# EasyEDA Pro project ProPrj_小中心板_2025-08-09.epro, board PCB1_1
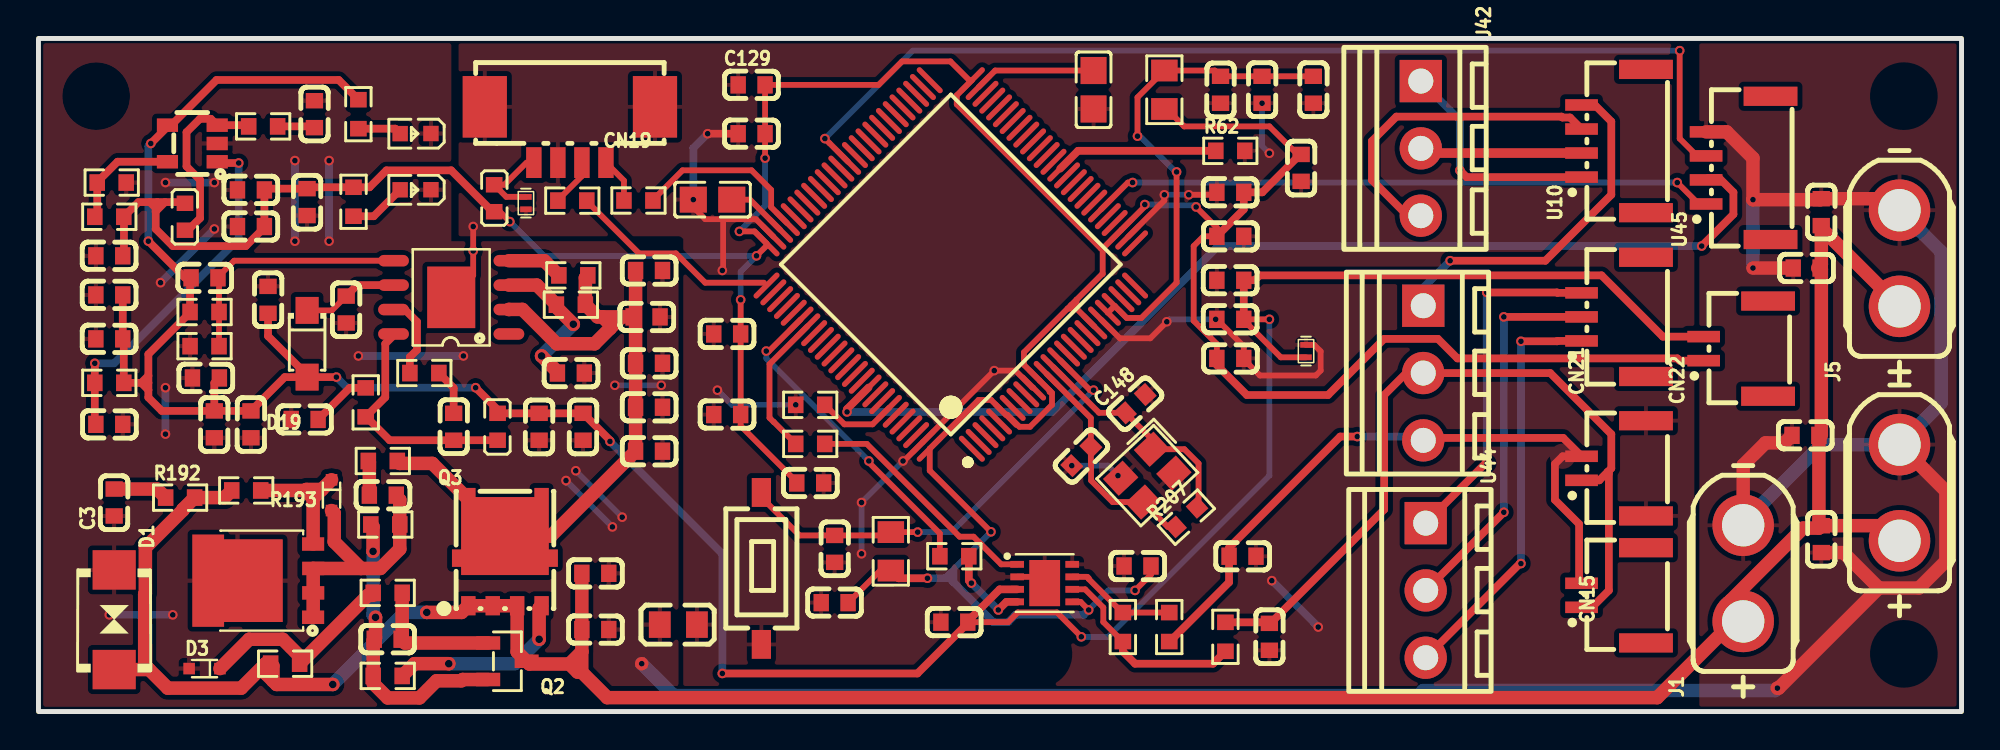
[diagram p8: board, top side]
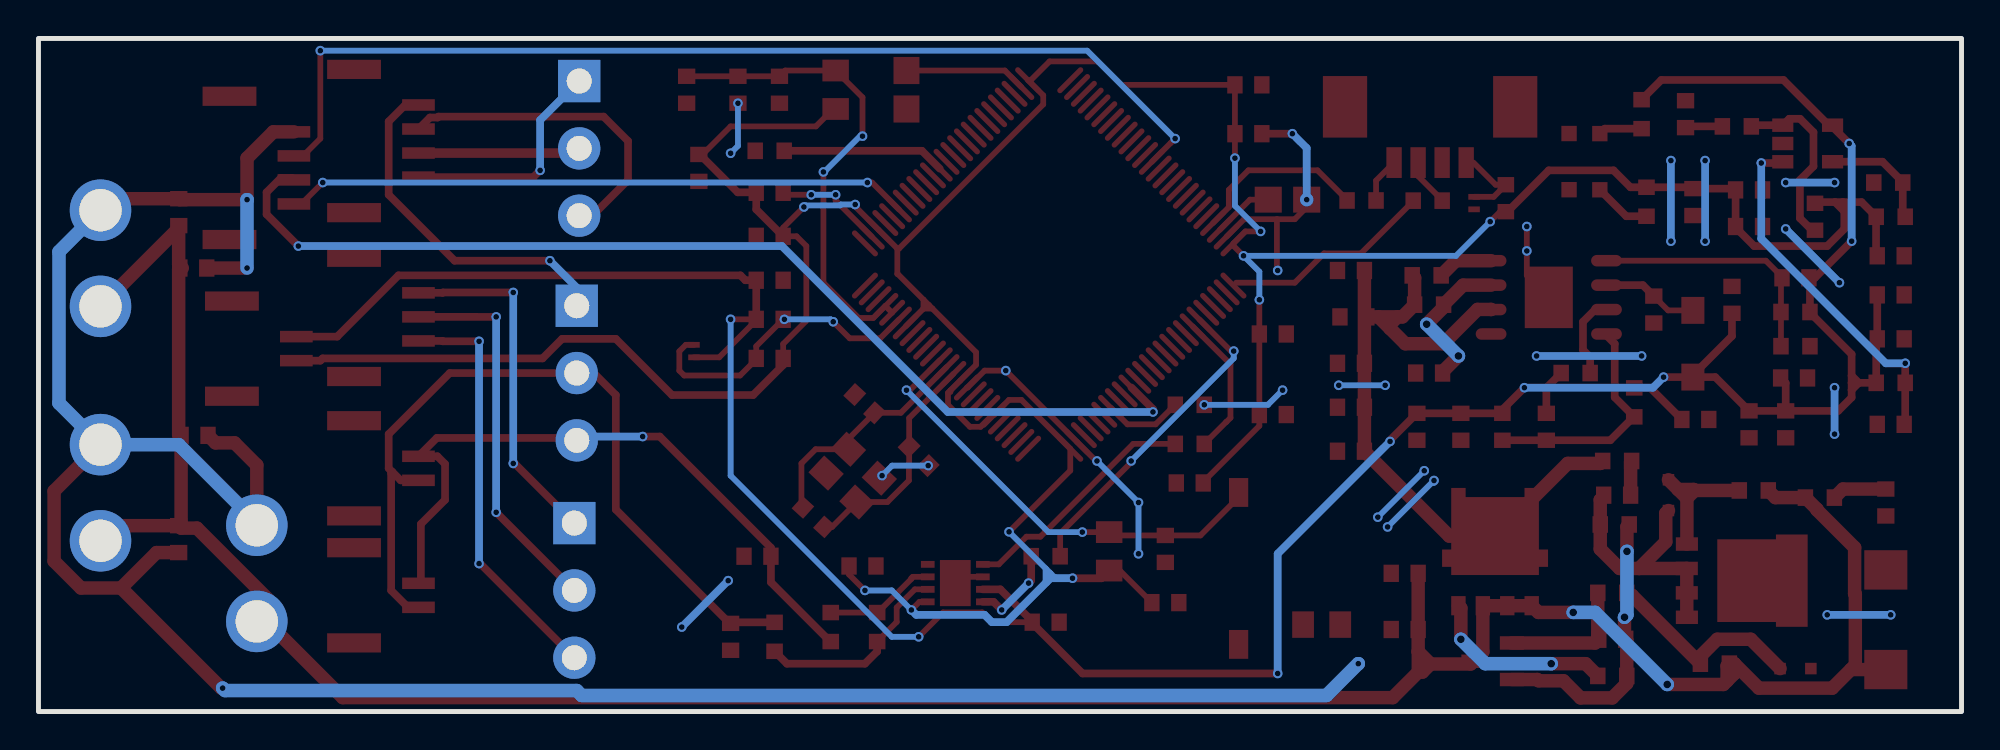
[diagram p9: board, bottom side, seen from below]

Outline 100 x 35 mm; copper layers: Top Layer, Bottom Layer. Coordinates in mm from the lower left corner of the outline.
Outline path: rectangle 0,35 100,0
Stack: Top Layer 0.035mm / Dielectric1 1.51mm FR4 er 4.5 / Bottom Layer 0.035mm

## Design rules (mm)
net VCC_5V: DP1
net SWCLK: DP1
template: JLCPCB Capability(Two Layers Board)
spacing copperThickness1oz (default): track to track 0.102, other pairs 0.152 to 0.3
spacing copperThickness2oz: track to track 0.203, other pairs 0.152 to 0.3
track width copperThickness1oz (default): min 0.127, default 0.254, max 2.54
track width copperThickness2oz: min 0.203, default 0.254, max 2.54
differential pair differentialPair (default): width min 0.127, default 0.254, max 2.54; gap min 0.152, default 0.152
via viaSize (default): diameter min 0.5, default 0.61, max 10; hole min 0.3, default 0.305, max 6.3

## Placement (name value [footprint] x y rotation side)
2.2uf  100nF  [C0603]  61.47 32.33 90 top
C1  22uf  [C0603]  28.96 4.27 180 top
C2  100nF  [C0603]  18.16 3.76 0 top
C3  10nf  [C0603]  3.94 10.87 90 top
C4  22uF  [C0603]  28.96 7.19 180 top
C29  330pF  [C0603]  13.84 15.19 0 top
C31  22uF  [C0603]  11.94 21.41 270 top
C32  22uF  [C0603]  8.71 17.35 0 top
C34_107  106  [C0603]  66.29 32.33 270 top
C35_105  104  [C0603]  63.63 32.33 270 top
C39  10uF  [C0603]  3.68 21.67 0 top
C40  1uF  [C0603]  3.68 14.93 180 top
C41  100pF  [C0603]  14.35 31.06 270 top
C43  1nF  [C0603]  11.05 25.22 0 top
C44  22uF  [C0603]  13.97 26.49 90 top
C93  1uF  [C0603]  27.69 17.6 180 top
C98  2.2uf  [C0805]  54.86 32.33 270 top
C99  2.2uf  [C0805]  35.05 26.62 180 top
C102  104  [c0603]  41.4 8.46 270 top
C104  10uF  [C0603]  31.75 13.54 180 top
C105  4.7uf  [C0603]  31.75 22.94 180 top
C106  4.7uf  [C0603]  31.62 20.52 180 top
C107  4.7uf  [C0603]  31.75 18.11 180 top
C108  100nf  [C0603]  31.75 15.82 180 top
C109  100nf  [C0603]  21.59 14.81 270 top
C110  1uF  [C0603]  11.05 14.93 90 top
C111  47pF  [C0603]  8.64 22.55 180 top
C112  1uF  [C0603]  28.32 14.81 90 top
C113  100nF  [C0603]  26.03 14.81 90 top
C114  1nF  [C0603]  9.14 14.93 90 top
C118  10nf  [C0603]  17.91 11.25 180 top
C124  100nf  [C0603]  16 20.9 90 top
C125  4.7uF  [C0603]  61.98 24.71 180 top
C126  4.7uF  [C0603]  41.4 5.66 0 top
C127  100nF  [C0603]  35.81 15.44 0 top
C128  100nf  [C0603]  35.81 19.63 0 top
C129  100nf  [C0603]  37.08 32.59 0 top
C130  100nf  [C0603]  61.98 18.36 180 top
C131  100nf  [C0603]  65.66 28.27 90 top
C132  100nf  [C0603]  61.98 27 0 top
C133  100nf  [C0603]  37.08 30.05 0 top
C134  100nf  [C0603]  40.13 11.89 180 top
C144  100nf  [C0603]  3.68 19.38 0 top
C145  1uF  [C0603]  11.05 27.13 0 top
C146  100nF  [C0603]  3.68 23.7 0 top
C147  12.0pF  [C0603]  54.23 13.28 225 top
C148  12.0pF  [C0603]  57.04 16.01 42.6 top
C157  1uF  [C0603]  61.98 20.39 0 top
C158  100nF  [C0603]  61.98 22.43 0 top
C165  330pF  [C0603]  62.61 8.08 180 top
C166  330pF  [C0603]  64.01 3.89 270 top
C167  100nF  [C0603]  57.15 7.57 180 top
C168  100nF  [C0603]  47.62 4.65 0 top
C169  22uf  [C0603]  91.95 23.06 0 top
C170  22uF  [C0603]  92.7 25.97 270 top
C175  22uf  [C0603]  91.88 14.36 0 top
C176  22uF  [C0603]  92.71 8.97 90 top
CN15  WAFER-GH1.25-2PLB  [CONN-TH_2P-P1.25_XUNPU_WAFER-GH1.25-2PLB]  81.91 6.04 90 top
CN18  WAFER-GH1.25-2PLB  [CONN-TH_2P-P1.25_XUNPU_WAFER-GH1.25-2PLB]  81.91 12.65 90 top
CN19  532610471  [CONN-SMD_4P-P1.25_53261-0471]  27.63 30 180 top
CN21  WAFER-GH1.25-3PLB  [CONN-SMD_3P-P1.25_XUNPU_WAFER-GH1.25-3PLB]  81.91 20.52 90 top
CN22  WAFER-GH1.25-2PLB  [CONN-TH_2P-P1.25_XUNPU_WAFER-GH1.25-2PLB]  88.26 18.87 90 top
D1  SMBJ30CA  [SMB_L4.3-W3.6-LS5.4-BI]  3.94 4.77 270 top
D2  BZX584C9V1  [SOD-523_L1.2-W0.8-LS1.6-FD]  15.24 11.25 90 top
D3  BZX584C9V1  [SOD-523_L1.2-W0.8-LS1.6-FD]  8.64 2.23 0 top
D19  DSS34  [SOD-123FL_L2.7-W1.8-LS3.8-RD]  13.97 19.12 270 top
D20  PESD5V0F1BL,315  [SOD-882_L1.0-W0.6-BI]  65.91 18.74 270 top
D25  PESD5V0F1BL,315  [SOD-882_L1.0-W0.6-BI]  25.35 26.44 270 top
J1  XT30UPB-F30.G.Y  [CONN-TH_XT30UPB-F]  88.65 7.19 90 top
J2  XT30UPB-F30.G.Y  [CONN-TH_XT30UPB-F]  96.77 11.38 90 top
J5  XT30UPB-F30.G.Y  [CONN-TH_XT30UPB-F]  96.77 23.57 90 top
L2  22uH  [L0603]  23.88 14.81 90 top
L3  BLM21PG221SN1D  [L0805]  33.27 4.52 0 top
L4  2.2uH  [L0603]  7.62 25.73 90 top
L6  10uH  [L0603]  23.7 26.69 270 top
LED_3V2  -  [LED_0603]  19.56 27.13 180 top
LED_5V2  -  [LED_0603]  19.56 30.05 180 top
Q1  PSMN1R4-40YLDX  [SOT-669_L4.9-W4.0-P1.27-LS6.0-BR]  12.32 6.81 0 top
Q2  PMBT3906,215  [SOT-23-3_L2.9-W1.3-P1.90-LS2.4-BR]  24.38 2.61 180 top
Q3  TPCA8106-VB  [DFN-5_L4.9-W5.9-P1.27-LS6.2-BL]  24.26 7.31 0 top
R27_0Ω2  0K  [R0805]  58.55 32.33 90 top
R30  10K  [R0805]  44.32 8.33 90 top
R60  10K  [R0603]  40.13 15.95 0 top
R62  10K  [R0603]  61.98 29.16 0 top
R184  12R  [R0603]  40.13 13.92 0 top
R189  330KR  [R0603]  27.69 21.16 0 top
R190  562KR  [R0603]  27.81 22.68 0 top
R191  2R  [R0603]  20.07 17.6 0 top
R192  33R  [R0603]  7.37 11.12 0 top
R193  100kΩ  [R0603]  10.8 11.5 180 top
R194  100kΩ  [R0603]  12.83 2.49 180 top
R195  1KΩ  [R0603]  18.16 6.17 180 top
R196  1KΩ  [R0603]  18.16 1.85 180 top
R197  33R  [R0603]  17.91 13.03 0 top
R198  10kΩ  [R0603]  18.03 9.73 180 top
R200  4.7R  [R0603]  17.02 16.08 270 top
R202  100kΩ  [R0603]  8.64 20.78 180 top
R204  30.9KR  [R0603]  8.64 19 0 top
R207  1M  [R0603]  59.69 10.11 42.3 top
R208  10R  [R0603]  11.68 30.43 180 top
R209  52.3KR  [R0603]  3.68 25.73 0 top
R210  11.3KR  [R0603]  3.81 27.51 180 top
R211  330kR  [R0603]  3.68 17.09 0 top
R212  1k  [R0603]  16.38 26.51 270 top
R213  2k  [R0603]  16.64 31.06 270 top
R229  33R  [R0603]  47.62 8.08 180 top
R230  120R  [R0603]  56.39 4.39 90 top
R231  0R  [R0603]  61.72 3.89 270 top
R232  0R  [R0603]  58.8 4.39 90 top
R233  100R  [R0603]  31.2 26.57 0 top
R234  100R  [R0603]  27.76 26.57 0 top
RESET1  TS-1092S-B3D2-G  [SW-SMD_L6.1-W3.6-LS7.9]  37.59 7.44 270 top
U4  SY8501FCC  [SO-8_L4.9-W3.9-P1.27-LS6.0-BL-EP]  21.46 21.54 90 top
U5  SY8089A1AAC  [TSOT-23-5_L2.9-W1.6-P0.95-LS2.8-BR]  8 29.54 0 top
U10  WAFER-GH1.25-4PLB  [CONN-SMD_4P-P1.25_XUNPU_WAFER-GH1.25-4PLB]  81.91 29.67 90 top
U34  -  [407vgt6]  47.5 25.47 90 top
U41  TJA1044GTK/3  [HVSON-8_L3.0-W3.0-P0.65-BL-EP]  52.32 6.68 270 top
U42  DB125-3.5-3P-GN-S  [CONN-TH_3P-P3.50_L7.4-W10.5]  71.88 29.28 270 top
U43  DB125-3.5-3P-GN-S  [CONN-TH_3P-P3.50_L7.4-W10.5]  72.01 17.6 270 top
U44  DB125-3.5-3P-GN-S  [CONN-TH_3P-P3.50_L7.4-W10.5]  72.14 6.3 270 top
U45  WAFER-GH1.25-4PLB  [CONN-SMD_4P-P1.25_XUNPU_WAFER-GH1.25-4PLB]  88.39 28.27 90 top
X1  12MHz  [CRYSTAL-SMD_4P-L3.2-W2.5-BL]  57.66 12.27 223.2 top

## Footprints (pads in the part's own frame, mm; a bottom-side part is the same pattern mirrored in y, then rotated)
407vgt6
  oval 0.28x1.796 smd rot 135: 1(-11.809,-1.04) 2(-11.456,-1.393) 3(-11.101,-1.747) 4(-10.748,-2.1) 5(-10.395,-2.454) 6(-10.041,-2.808) 7(-9.688,-3.161) 8(-9.334,-3.514) 9(-8.98,-3.868) 10(-8.627,-4.221) 11(-8.273,-4.575) 12(-7.92,-4.929) 13(-7.566,-5.282) 14(-7.213,-5.636) 15(-6.859,-5.989) 16(-6.505,-6.343) 17(-6.152,-6.697) 18(-5.798,-7.05) 19(-5.445,-7.404) 20(-5.091,-7.758) 21(-4.737,-8.111) 22(-4.384,-8.464) 23(-4.03,-8.818) 24(-3.677,-9.171) 25(-3.324,-9.525) 51(7.354,1.152) 52(7,1.506) 53(6.646,1.859) 54(6.293,2.213) 55(5.939,2.567) 56(5.586,2.92) 57(5.232,3.273) 58(4.879,3.627) 59(4.525,3.981) 60(4.172,4.334) 61(3.818,4.688) 62(3.465,5.041) 63(3.111,5.395) 64(2.757,5.748) 65(2.404,6.102) 66(2.05,6.455) 67(1.697,6.809) 68(1.343,7.162) 69(0.99,7.516) 70(0.636,7.87) 71(0.282,8.223) 72(-0.071,8.577) 73(-0.424,8.931) 74(-0.778,9.284) 75(-1.131,9.637)
  oval 1.796x0.28 smd rot 135: 26(-1.131,-9.525) 27(-0.778,-9.171) 28(-0.424,-8.818) 29(-0.071,-8.464) 30(0.282,-8.111) 31(0.636,-7.758) 32(0.99,-7.404) 33(1.343,-7.05) 34(1.697,-6.697) 35(2.05,-6.343) 36(2.404,-5.989) 37(2.757,-5.636) 38(3.111,-5.282) 39(3.465,-4.928) 40(3.818,-4.575) 41(4.172,-4.221) 42(4.525,-3.868) 43(4.879,-3.514) 44(5.232,-3.161) 45(5.586,-2.808) 46(5.939,-2.454) 47(6.293,-2.1) 48(6.646,-1.747) 49(7,-1.393) 50(7.354,-1.04) 76(-3.324,9.637) 77(-3.677,9.284) 78(-4.03,8.931) 79(-4.384,8.577) 80(-4.737,8.223) 81(-5.091,7.87) 82(-5.445,7.516) 83(-5.798,7.162) 84(-6.152,6.809) 85(-6.505,6.455) 86(-6.859,6.102) 87(-7.213,5.748) 88(-7.566,5.395) 89(-7.92,5.042) 90(-8.273,4.688) 91(-8.627,4.334) 92(-8.98,3.981) 93(-9.334,3.627) 94(-9.688,3.273) 95(-10.041,2.92) 96(-10.395,2.567) 97(-10.748,2.213) 98(-11.101,1.859) 99(-11.456,1.506) 100(-11.809,1.152)
C0603
  rect 0.8x0.9 smd: 1(-0.7,0) 2(0.7,0)
c0603
  rect 0.8x0.9 smd: 1(-0.7,0) 2(0.7,0)
C0805
  rect 1.41x1.35 smd: 1(-1,0) 2(1,0)
CONN-SMD_3P-P1.25_XUNPU_WAFER-GH1.25-3PLB
  rect 0.6x1.7 smd: 1(-1.25,1.675) 2(0.001,1.675) 3(1.25,1.675)
  rect 1x2.8 smd: 4(3.1,-1.675) 5(-3.1,-1.675)
CONN-SMD_4P-P1.25_53261-0471
  rect 0.8x1.6 smd: 1(-1.875,1.45) 2(-0.625,1.45) 3(0.625,1.45) 4(1.875,1.45)
  rect 2.3x3.2 smd: 5(4.425,-1.45) 6(-4.425,-1.45)
CONN-SMD_4P-P1.25_XUNPU_WAFER-GH1.25-4PLB
  rect 0.6x1.7 smd: 1(-1.875,1.675) 2(-0.625,1.675) 3(0.625,1.675) 4(1.875,1.675)
  rect 1x2.8 smd: 5(-3.725,-1.675) 6(3.725,-1.675)
CONN-TH_2P-P1.25_XUNPU_WAFER-GH1.25-2PLB
  rect 0.6x1.7 smd: 1(-0.625,1.675) 2(0.625,1.675)
  rect 1x2.8 smd: 3(2.475,-1.675) 4(-2.475,-1.675)
CONN-TH_3P-P3.50_L7.4-W10.5
  rect 2.2x2.2 hole 1.3: 1(-3.5,0)
  round 2.2 hole 1.3: 2(0,0) 3(3.5,0)
CONN-TH_XT30UPB-F
  round 3.2 hole 2.2: 1(-2.5,0) 2(2.5,0)
CRYSTAL-SMD_4P-L3.2-W2.5-BL
  rect 1.4x1.2 smd: 1(-1.1,-0.85) 2(1.1,-0.85) 3(1.1,0.85) 4(-1.1,0.85)
DFN-5_L4.9-W5.9-P1.27-LS6.2-BL
  rect 0.75x1 smd: 1(-1.905,-1.811) 2(-0.635,-1.811) 3(0.635,-1.811) 4(1.905,-1.811)
  custom 5.51x4.53 smd: 5(0,1.811)
HVSON-8_L3.0-W3.0-P0.65-BL-EP
  rect 0.355x0.711 smd: 1(-0.975,-1.433) 2(-0.325,-1.433) 3(0.325,-1.433) 4(0.975,-1.433) 5(0.975,1.433) 6(0.325,1.433) 7(-0.325,1.433) 8(-0.975,1.433)
  rect 2.4x1.6 smd: 9(0,0)
L0603
  rect 0.8x0.864 smd: 1(-0.7,0) 2(0.7,0)
L0805
  rect 1.133x1.377 smd: 1(-0.966,0) 2(0.966,0)
LED_0603
  rect 0.8x0.8 smd: 1(-0.851,-0.01) 2(0.75,-0.005)
R0603
  rect 0.806x0.864 smd: 1(-0.753,0) 2(0.753,0)
R0805
  rect 1.133x1.377 smd: 1(-1,0) 2(1,0)
SMB_L4.3-W3.6-LS5.4-BI
  rect 2.047x2.241 smd: 1(-2.591,0) 2(2.591,0)
SO-8_L4.9-W3.9-P1.27-LS6.0-BL-EP
  oval 0.6x1.6 smd: 1(-1.905,-3) 2(-0.635,-3) 3(0.635,-3) 4(1.905,-3) 5(1.905,3) 6(0.635,3) 7(-0.635,3) 8(-1.905,3)
  rect 3.2x2.5 smd: 9(0,0)
SOD-123FL_L2.7-W1.8-LS3.8-RD
  rect 1.4x1.2 smd: 1(-1.735,0) 2(1.735,0)
SOD-523_L1.2-W0.8-LS1.6-FD
  rect 0.6x0.6 smd: 1(-0.8,0) 2(0.8,0)
SOD-882_L1.0-W0.6-BI
  rect 0.3x0.6 smd: 1(-0.325,0) 2(0.325,0)
SOT-23-3_L2.9-W1.3-P1.90-LS2.4-BR
  rect 1.25x0.7 smd: 1(1,-0.95) 2(1,0.95) 3(-1,0)
SOT-669_L4.9-W4.0-P1.27-LS6.0-BR
  rect 1.15x0.7 smd: 1(1.962,-1.905) 2(1.968,-0.635) 3(1.968,0.635) 4(1.962,1.905)
  custom 4.7x4.8 smd: 5(-1.968,0)
SW-SMD_L6.1-W3.6-LS7.9
  rect 1.5x1 smd: 1(-3.95,0) 2(3.95,0)
TSOT-23-5_L2.9-W1.6-P0.95-LS2.8-BR
  rect 1.1x0.7 smd: 1(1.294,-0.951) 2(1.294,-0.001) 3(1.294,0.951) 4(-1.294,0.951) 5(-1.294,-0.949)

## Nets
As in the schematic.

Pads without a net: CN15 3 4; CN21 4 5; CN22 3 4; U4 1; U10 5 6; U34 1 2 3 4 5 7 8 9 15 16 17 18 23 24 25 26 29 30 32 33 34 35 36 38 39 40 41 42 43 44 45 46 47 48 51 52 53 54 55 56 57 58 59 60 61 62 64 65 66 67 68 69 70 71 77 78 79 80 83 84 85 86 87 88 89 90 92 93 95 96 97 98; U45 5 6

## Via types
v1: diameter 0.7, hole 0.4, Top Layer to Bottom Layer, 8 vias
v2: diameter 0.5, hole 0.3, Top Layer to Bottom Layer, 85 vias
v3: diameter 0.7, hole 0.3, Top Layer to Bottom Layer, 4 vias

## Routing (per net, layer and track width the routed paths; a pad name or vN(x,y) marks a point on that pad's centre or on a via; arc(x,y) is an arc through that point)
12V: length 8.5
  Top Layer w0.5: U10.2 72.13,29.04 U42.2
GND: length 68.7
  Top Layer w0.3: 35.6,25.6 37.31,25.6 U34.74 ; 35.6,25.6 34.67,25.6 34.05,26.22 v3(34.05,26.62) ; 35.6,25.6 35.6,22.98 v2(35.56,22.94) ; v2(56.13,12.27) 56.27,12.13 X1.2 ; U4.9 22.61,22.68 v2(22.61,23.95) v2(22.61,25.22) ; U34.27 58.55,26.57 v2(58.55,26.87) ; U34.20 56.23,19.41 57.81,19.41 v2(58.67,20.27) ; U41.2 52,7 U41.9 ; D20.1 66.34,19.07 66.68,18.73 66.68,17.73 66.42,17.47 63.51,17.47 62.68,18.31 C130.1 62.68,19 C157.1 v2(61.21,20.39) ; v2(59.82,26.87) 61.15,26.87 C132.1 ; U34.10 51.68,16.85 50.8,17.73 v2(49.7,17.73) U34.99 45,13.03 v2(44.96,13.03)
  Top Layer w0.4: v2(34.8,30.05) C133.1
  Bottom Layer w0.3: v2(35.31,16.71) 36.07,15.95 v2(39.38,15.95) ; v2(64.01,29.03) 63.63,29.41 v2(63.63,31.63) ; v2(61.21,20.39) 58.8,20.39 v2(58.67,20.27) ; v2(42.8,8.2) v2(42.8,10.87) v2(44.96,13.03) ; v2(56.13,12.27) 55.61,12.79 v2(53.73,12.79) ; v2(58.55,26.87) v2(59.82,26.87)
  Bottom Layer w0.4: v2(34.8,30.05) 34.05,29.3 v3(34.05,26.62) ; v2(66.55,4.39) v2(64.13,6.81)
GND1: length 21.7
  Top Layer w0.4: v2(77.09,19.25) 78.97,19.25 78.99,19.27 CN21.1 ; U44.3 77.03,7.69 v2(77.09,7.69)
  Bottom Layer w0.4: v2(77.09,7.69) v2(77.09,19.25)
GND2: length 12
  Top Layer w0.4: U10.1 74.26,27.79 v2(73.91,28.14)
  Bottom Layer w0.4: U42.1 73.91,30.75 v2(73.91,28.14)
PGND: length 166.4
  Top Layer w0.7: 95.7,6.42 93.86,8.27 C176.1 ; 95.7,6.42 97.79,6.42 99.19,7.82 99.19,11.47 J2.2 ; 95.7,6.42 90.49,1.22 v3(90.42,1.22) ; J5.2 96.18,26.67 C170.1 92.66,26.62 v3(89.15,26.62) 89.15,28.78 87.79,30.14 U45.4 ; C169.1 v2(89.15,23.06) ; J1.2 88.65,12.81 89.8,13.97 90.79,13.97 C175.1
  Bottom Layer w0.3: v2(27.94,12.52) v2(30.35,10.11) ; v2(29.84,9.6) 27.56,11.89 27.43,11.89 ; v2(29.97,16.97) v2(32.38,16.97)
  Bottom Layer w0.4: v2(9.14,25.09) v2(6.35,22.3) ; v2(13.33,28.65) v2(13.33,24.46) ; v2(6.6,16.84) v2(6.6,14.43) ; v2(6.98,5.03) v2(3.68,5.03) ; v2(6.6,27.51) v2(9.14,27.51) ; v2(16.64,18.49) v2(22.1,18.49) ; v2(15.11,24.46) v2(15.11,28.65)
  Bottom Layer w0.7: 88.52,9.69 92.71,13.88 J2.2 98.93,16.04 98.93,23.91 J5.2 ; v2(89.15,23.06) v3(89.15,26.62) ; v3(90.42,1.22) 90.3,1.09 72.01,1.09 71.75,0.84 33.02,0.84 v3(31.37,2.49)
  vias: v2(27.43,12.01)
VCC_3V3: length 202.4
  Top Layer w0.3: v2(37.34,23.7) 37.86,24.22 U34.75 37.24,24.97 v2(36.45,24.97) ; v2(24.51,25.47) 23.99,25.99 L6.2 ; C134.2 39.43,11.94 36.51,14.85 C127.2 C128.2 v2(36.51,21.41) ; 53.52,20.95 53.98,20.95 ; 53.52,20.95 53.7,21.14 ; 53.52,20.95 51.24,18.68 51.24,18.03 U34.11 52.58,16.7 ; 53.98,20.95 53.98,21.41 ; 53.98,20.95 53.79,21.14 53.7,21.14 ; 53.98,20.95 U34.19 ; C126.2 43.77,7.33 R30.1 ; 53.98,21.41 53.7,21.14 ; 53.98,21.41 55.32,22.76 55.34,22.76 55.34,24.07 ; 55.34,24.07 55.25,24.07 47.75,31.57 47.75,32.04 U34.50 48.4,32.83 47.42,33.81 44.91,33.81 43.69,32.59 C129.2 C133.2 v2(37.78,28.78) ; 55.34,24.07 U34.28 57.53,26.27 v2(57.53,26.36) ; 52.58,16.7 52.71,16.57 52.71,15.95 51.56,14.81 51.01,14.81 50.38,15.43 U34.6 49.54,16.2 48.88,16.2 U34.100 46.35,12.53 v2(49.53,9.35) ; 52.58,16.7 52.58,16.61 ; C130.2 61.28,19.11 60.07,20.32 60.07,24.2 60.58,24.71 C125.2 61.28,25.16 v2(60.2,26.24) ; U41.5 54.19,5.7 v2(54.61,5.28) ; C167.1 57.85,7.12 v2(57.02,6.3) ; R27_0Ω2.1 58.67,31.33 59.57,30.43 64.01,30.43 65.47,28.97 65.61,28.97
  Top Layer w0.4: 6.1,26.01 6.1,26.19 ; 6.1,26.01 6.1,25.09 6.98,24.2 10.78,24.2 11.75,25.17 11.75,27.13 11.81,27.19 C44.2 14.04,27.26 R212.1 17.22,27.26 18.1,28.14 21.46,28.14 23.61,25.99 L6.2 ; 6.1,26.01 6.1,26.01 6.58,26.49 ; 6.1,26.19 5.79,26.49 ; 6.1,26.19 6.1,26.41 6.17,26.49 ; C125.2 62.68,26.11 C132.2 63.64,27 65.61,28.97 65.66,28.97 ; L4.2 7.56,26.49 6.58,26.49 ; R30.1 44.72,6.93 46.22,6.93 v2(46.23,6.93) ; CN22.1 85.34,18.25 85.22,18.36 73.79,18.36 72.77,19.38 69.98,19.38 67.06,16.46 62.84,16.46 61.28,18.02 C130.2 ; 5.79,26.49 6.17,26.49 ; 5.79,26.49 5.2,26.49 R209.2 4.44,25.72 4.44,23.76 C146.2 ; 6.17,26.49 6.58,26.49
  Bottom Layer w0.3: v2(36.45,24.97) 37.78,26.3 v2(37.78,28.78) ; 47.63,7.44 47.37,7.19 ; 47.63,7.44 v2(49.53,9.35) ; 47.63,7.44 47.63,6.78 47.58,6.73 ; 47.37,7.19 47.12,6.93 ; 47.37,7.19 47.37,6.93 ; v2(36.51,21.41) 36.51,22.87 v2(37.34,23.7) 26.29,23.7 v2(24.51,25.47) ; v2(57.02,6.3) 55.63,6.3 v2(54.61,5.28) ; v2(60.2,26.24) 60.12,26.32 58.32,26.32 58.27,26.36 v2(57.53,26.36)
  Bottom Layer w0.4: v2(46.23,6.93) 47.37,6.93 49.66,4.65 50.42,4.65 50.8,5.03 54.36,5.03 v2(54.61,5.28)
VCC_5V: length 159.8
  Top Layer w0.3: D20.2 64.6,18.42 62.68,20.34 ; C168.2 50.42,4.65 50.93,5.16 52.96,5.16 v2(54.23,3.89) ; C157.2 v2(64.01,20.39)
  Top Layer w0.4: C32.2 9.14,17.08 C114.2 ; v2(29.72,14.05) 29.72,14.11 C112.2 C113.2 L2.2 23.88,15.7 v2(22.73,16.84) ; U41.3 49.98,6.35 48.32,4.7 C168.2 48.32,4.6 45.71,1.98 v2(35.56,1.98) ; C114.2 6.41,15.63 5.72,16.33 5.72,16.72 ; C114.2 C110.2 12.81,17.39 D19.2 ; D19.2 v2(15.49,17.39) ; D19.2 13.97,17.49 11.94,19.52 C31.2 ; C39.2 C144.2 4.44,19.33 R211.2 5.34,17.09 ; 5.72,17.46 5.72,18.58 7.88,20.75 R202.2 7.88,22.5 C111.2 7.62,22.55 v2(5.72,24.46) ; 5.72,17.46 5.34,17.09 ; 5.72,17.46 5.72,17.09 ; CN22.2 84.47,19.5 81.28,22.68 63.5,22.68 63.24,22.43 C158.2 C157.2 ; 5.34,17.09 5.72,16.72 ; 5.34,17.09 5.72,17.09 ; R213.1 15.61,32.84 9.26,32.84 6.91,30.49 U5.4 6.71,30.4 v2(5.84,29.54) ; 5.72,16.72 5.72,17.09
  Bottom Layer w0.3: v2(54.23,3.89) 55.63,3.89 64.01,12.27 v2(64.01,20.39)
  Bottom Layer w0.4: v2(5.84,29.54) 5.72,29.41 v2(5.72,24.46) ; v2(29.72,14.05) 35.56,8.2 v2(35.56,1.98) ; v2(15.49,17.39) 16.05,16.84 v2(22.73,16.84)
VCC_24V: length 37.5
  Top Layer w0.7: R190.2 28.44,22.55 R189.2 29.07,20.52 29.33,20.52 ; 29.72,19.92 30.32,20.52 ; 29.72,19.92 29.72,20.13 29.33,20.52 ; 29.72,19.92 28.92,19.12 26.95,19.12 25.17,20.91 24.47,20.91 24.46,20.9 ; 30.32,20.52 C106.2 ; 30.32,20.52 29.33,20.52 ; C105.2 C107.2 C108.2 C104.2 26.64,9.12 Q3.5 20.48,12.9 18.79,12.9 R197.2
VCC_BAT: length 145.4
  Top Layer w0.7: 92.71,25.13 92.7,25.14 C170.2 92.71,25.26 92.71,25.13 ; 92.71,25.13 J5.1 ; 92.71,25.13 92.71,23.25 92.52,23.06 ; 11.81,2.49 R194.2 12.19,2.37 12.19,1.6 ; 11.81,2.49 11.81,1.98 12.19,1.6 ; 11.81,2.49 10.54,1.22 6.72,1.22 5.52,2.42 5.52,6.1 5.56,6.13 5.56,8.53 7.52,10.48 7.52,10.52 R192.2 9.68,11.12 R193.2 ; 27.61,2.47 28.03,2.05 28.25,2.05 ; 27.61,2.47 25.53,2.47 Q2.3 24.89,3.11 24.89,5.5 22.35,5.5 22,5.16 v1(20.19,5.16) ; 27.61,2.47 28.26,3.12 C1.2 C4.2 ; 12.19,1.6 12.38,1.41 v1(15.3,1.41) ; C176.2 95.99,9.67 J2.1 ; C176.2 92.58,9.79 C175.2 ; C176.2 92.58,9.54 91.76,9.54 88.01,5.79 88.01,4.56 84.17,0.72 29.58,0.72 28.25,2.05 ; 92.71,14.36 92.71,23 C169.2 ; 28.25,2.05 28.25,3.11 ; D1.2 5.76,2.18
  Bottom Layer w0.7: v1(15.3,1.41) 19.05,5.16 v1(20.19,5.16)
BOOT0: length 4.2
  Top Layer w0.3: R60.2 40.89,15.82 41.01,15.7 41.15,15.7 41.91,14.93 43.37,14.93 U34.94
BOOT1: length 8.5
  Top Layer w0.4: U34.37 54.06,29.16 R62.1
CAN1_H: length 35.5
  Top Layer w0.4: v2(68.58,14.3) 67.69,14.3 61.91,8.52 C165.2 61.91,6.72 58.83,3.64 R232.1 ; 72.14,14.23 79.28,14.23 CN18.2 ; 80.11,6.67 80.11,9.75 78.86,11.01 78.86,12.87 79.26,13.27 80.11,13.27
  Bottom Layer w0.4: 72.14,14.23 72.06,14.3 v2(68.58,14.3)
CAN1_L: length 42.1
  Top Layer w0.4: 81.6,12.46 81.66,12.4 81.66,6.3 80.78,5.42 80.11,5.42 ; 81.6,12.46 81.16,12.02 CN18.1 ; 81.6,12.46 81.79,12.65 81.79,14.43 78.61,17.6 U43.2 ; 72.14,17.73 71.25,17.73 69.98,16.46 69.98,10.5 64.06,4.58 64.01,4.58 63.95,4.64 R231.1
CAN1_RX: length 16.9
  Top Layer w0.3: R229.2 46.87,9.26 43.18,12.95 v2(43.18,13.03) ; v2(37.85,18.74) 37.99,18.74 U34.81
  Bottom Layer w0.3: v2(37.85,18.74) 37.85,18.36 v2(43.18,13.03)
CAN1_TX: length 12.6
  Top Layer w0.3: R184.2 43.07,13.92 47.9,9.09 48.62,9.09 50.06,7.65 U41.1
CAN2_H: length 18.4
  Top Layer w0.4: v2(73.41,23.44) 78.36,23.44 81.79,26.87 81.79,30.68 80.93,31.54 U10.4
  Bottom Layer w0.4: v2(73.41,23.44) 72.01,22.05 U43.1
CAN2_L: length 17
  Top Layer w0.4: U42.3 71.19,25.78 69.34,27.63 69.34,29.67 70.61,30.94 79.2,30.94 79.24,30.89 79.64,30.89 U10.3
CH1: length 32.5
  Top Layer w0.3: U45.1 86.33,26.39 v2(85.22,27.51) ; 55.26,26.11 56.65,27.51 v2(56.9,27.51)
  Bottom Layer w0.3: v2(56.9,27.51) v2(85.22,27.51)
CH2: length 55
  Top Layer w0.4: v2(86.49,24.2) 88.14,25.86 88.14,27 87.39,27.75 86.82,27.75 U45.2 ; v2(42.05,15.58) 42.05,15.73 U34.91
  Bottom Layer w0.4: v2(42.05,15.58) 52.71,15.58 61.34,24.2 v2(86.49,24.2)
CH3: length 54.4
  Top Layer w0.3: 41.12,29.56 v2(40.89,29.79) ; 42.1,28.59 41.13,29.56 ; v2(85.34,34.36) 85.34,29.79 86.24,28.89 U45.3
  Bottom Layer w0.3: v2(85.34,34.36) 45.47,34.36 v2(40.89,29.79)
FB02: length 13.1
  Top Layer w0.3: R204.2 R202.1 9.39,22.5 C111.1 9.34,22.6 10.17,23.44 U4.5
FB03: length 5.9
  Top Layer w0.4: U5.5 4.11,28.59 3.06,27.54 R210.2 3.06,25.86 R209.1
OSC_IN: length 11.9
  Top Layer w0.3: 59.13,9.6 58.73,9.6 X1.3 55.86,10.89 54.74,12.01 54.74,12.86 54.72,12.88 C147.1 54.72,15.26 U34.12
OSC_OUT: length 12.3
  Top Layer w0.3: 60.25,10.61 60.32,10.69 60.32,12.9 59.59,13.64 X1.1 57.88,14.18 56.52,15.53 55.15,15.53 U34.13
RESET: length 23.8
  Top Layer w0.3: U34.14 54.68,16.71 v2(54.86,16.71) ; RESET1.1 37.59,11.14 39.58,9.16 C102.1 44.15,9.16 R30.2 v2(45.72,9.33)
  Bottom Layer w0.3: v2(45.72,9.33) 47.48,9.33 v2(54.86,16.71)
RX: length 18.3
  Top Layer w0.4: U44.1 75.24,12.9 v2(75.31,12.9) ; CN21.3 78.99,21.77 78.97,21.79 v2(75.31,21.79)
  Bottom Layer w0.4: v2(75.31,12.9) v2(75.31,21.79)
SWCLK: length 11
  Top Layer w0.3: R234.2 28.51,26.54 31.23,23.82 33.15,23.82 34.67,22.3 37.72,22.3
SWDIO: length 9.3
  Top Layer w0.3: U34.72 38.1,26.22 38.1,27.13 37.08,28.14 33.49,28.14 31.95,26.6 R233.2
SY8510_VCC: length 5
  Top Layer w0.3: C124.2 15.26,20.86 D19.1
  Top Layer w0.4: U4.6 16.57,22.17 C124.2
TX: length 19.9
  Top Layer w0.4: U44.2 v2(76.2,10.36) ; v2(76.2,20.52) CN21.2
  Bottom Layer w0.4: v2(76.2,10.36) v2(76.2,20.52)
$1N3075: length 2.9
  Top Layer w0.7: R192.1 6.17,11.57 C3.2
$1N3077: length 10.8
  Top Layer w0.7: D3.2 10.96,3.76 12.7,3.76 13.58,2.88 R194.1 17.14,6.04 17.41,6.04
$1N3078: length 6.9
  Top Layer w0.7: Q2.1 19.05,3.56 C2.2 18.91,3.81 18.91,6.04
$1N3080: length 7.5
  Top Layer w0.7: 13.88,11.5 13.93,11.55 14.74,11.55 ; 13.88,11.5 14.28,11.09 ; 13.88,11.5 R193.1 ; Q1.4 14.28,11.09 ; 14.28,11.09 14.74,11.55 ; 14.74,11.55 D2.2
$1N3082: length 15.1
  Top Layer w0.7: Q2.2 22.06,1.67 21.99,1.6 20.7,1.6 19.81,0.71 18.16,0.71 17.41,1.46 R196.2 17.41,3.7 C2.1 17.53,3.82 v1(17.53,4.9) ; R198.2 17.4,9.61 v1(17.4,8.33)
  Bottom Layer w0.7: v1(17.53,4.9) 17.4,5.03 v1(17.4,8.33)
$1N3083: length 9.7
  Top Layer w0.7: 26.16,5.5 26.03,5.38 v1(26.03,3.76) ; v1(21.34,2.49) 19.55,2.49 R196.1
  Bottom Layer w0.7: v1(26.03,3.76) 24.77,2.49 v1(21.34,2.49)
$1N3084: length 1.8
  Top Layer w0.7: R197.1 17.21,12.98 C118.2
$1N3085: length 13.7
  Top Layer w0.7: Q1.1 14.29,4.91 Q1.3 16.76,7.44 ; 16.76,7.44 15.38,8.83 15.38,10.31 D2.1 ; 16.76,7.44 17.78,7.44 18.79,8.45 R198.1 18.79,11.01 18.73,11.06
$1N3107: length 7.8
  Top Layer w0.7: v1(27.81,20.14) 26.93,21.02 R189.1 25.92,22.17 U4.3 ; C93.2 26.99,17.67 v1(26.16,18.49)
  Bottom Layer w0.7: v1(27.81,20.14) v1(26.16,18.49)
$1N3108: length 2.9
  Top Layer w0.7: R190.1 26.3,23.44 U4.4
$1N3109: length 4.3
  Top Layer w0.4: 18.46,20.9 19.05,20.9 19.69,20.27 19.69,18.81 19.31,18.43 R191.1
$1N3112: length 2.4
  Top Layer w0.4: C109.1 21.59,16.83 R191.2
$1N3113: length 12.3
  Top Layer w0.4: U4.8 18.46,19.55 18.03,19.12 18.03,16.34 R200.2 17.05,15.32 18.26,14.11 C109.2 L2.1
$1N3138: length 3.2
  Top Layer w0.4: C29.2 16.19,16.83 R200.1
$1N5426: length 18.4
  Top Layer w0.4: v2(10.41,28.52) 9.36,28.52 U5.1 ; v2(2.93,18.11) R211.1 2.93,14.99 C40.2
  Bottom Layer w0.4: v2(10.41,28.52) 10.41,24.59 3.94,18.11 v2(2.93,18.11)
$1N5427: length 9.2
  Top Layer w0.4: R208.2 10.87,30.49 U5.3 8.96,30.82 8.4,30.82 7.7,30.13 7.7,28.35 8.4,27.64 8.4,25.65 7.87,25.12
$1N5428: length 1.9
  Top Layer w0.4: R208.1 14.29,30.43 C41.2
$2N4237: length 4.6
  Top Layer w0.4: v2(49.91,5.28) 50.33,5.7 U41.4 ; v2(48.51,6.68) 48.38,6.81 R229.1
  Bottom Layer w0.4: v2(49.91,5.28) v2(48.51,6.68)
$2N4239: length 10.6
  Top Layer w0.3: R230.1 55.37,4.66 55.37,5.41 54.43,6.35 U41.6
  Top Layer w0.4: R230.1 56.39,3.12 57.02,2.49 61.08,2.49 R231.2
$2N4240: length 5.8
  Top Layer w0.3: U41.7 54.54,7 54.61,6.93 54.61,6.9 56.36,5.15 R230.2 R232.2
$2N4258: length 2.4
  Top Layer w0.3: 29.51,28.55 30.44,27.61 R233.1
$2N4259: length 2.5
  Top Layer w0.3: R234.1 27.01,26.59 28.26,27.85 28.26,28.55
$2N4265: length 4.1
  Top Layer w0.3: 25.38,28.55 24.23,27.39 L6.1 24.33,26.76 D25.1
$3N639: length 6.3
  Top Layer w0.3: U34.49 49.75,33.33 C98.1
$3N640: length 3.2
  Top Layer w0.3: U34.73 37,26.62 C99.1
$3N650: length 7.5
  Top Layer w0.3: R184.1 38.24,15.06 38.23,15.06 38.01,15.27 38.01,18.06 U34.82
$3N662: length 25.2
  Top Layer w0.3: v2(59.18,28.06) 59.18,22.3 57.35,20.47 56.59,20.47 U34.22 U34.21 ; v2(57.15,29.92) 57.15,31.94 R27_0Ω2.2 61.17,33.33 2.2uf.2 C35_105.1 C34_107.1
  Bottom Layer w0.3: v2(57.15,29.92) 57.28,29.92 59.14,28.06 v2(59.18,28.06)
$3N2818: length 2.3
  Top Layer w0.4: R213.2 18.55,30.31 LED_5V2.2
$3N2819: length 3
  Top Layer w0.4: R212.2 17.43,25.75 LED_3V2.2

## Copper pours and planes (outline as drawn; the poured copper is in the pictures)
GND on Top Layer: 21.84,24.59 33.53,24.59 33.53,-0.56 86.11,-0.56 86.11,36.02 21.84,36.02
PGND on Top Layer: 85.34,36.27 100.84,36.27 100.84,-0.43 85.34,-0.43
PGND on Top Layer: -0.76,-1.07 -0.76,36.02 21.46,36.02 21.46,24.46 33.27,24.46 33.27,-1.07
PGND on Top Layer: -0.76,-1.19 -0.76,35.89 21.46,35.89 21.46,24.33 33.27,24.33 33.27,-1.19
